# Altium schematic sheet LEDMATRIX.SchDoc: LED MATRIX
size A4; Author: Silvio Navaretti; CompanyName: ARDUINO SRL; DrawnBy: Silvio Navaretti; Engineer: Silvio Navaretti; Organization: ARDUINO SRL; DocumentNumber: ABX00087; Revision: V1.1; SheetNumber: 2; SheetTotal: 2; RevAuthor: Silvio Navaretti
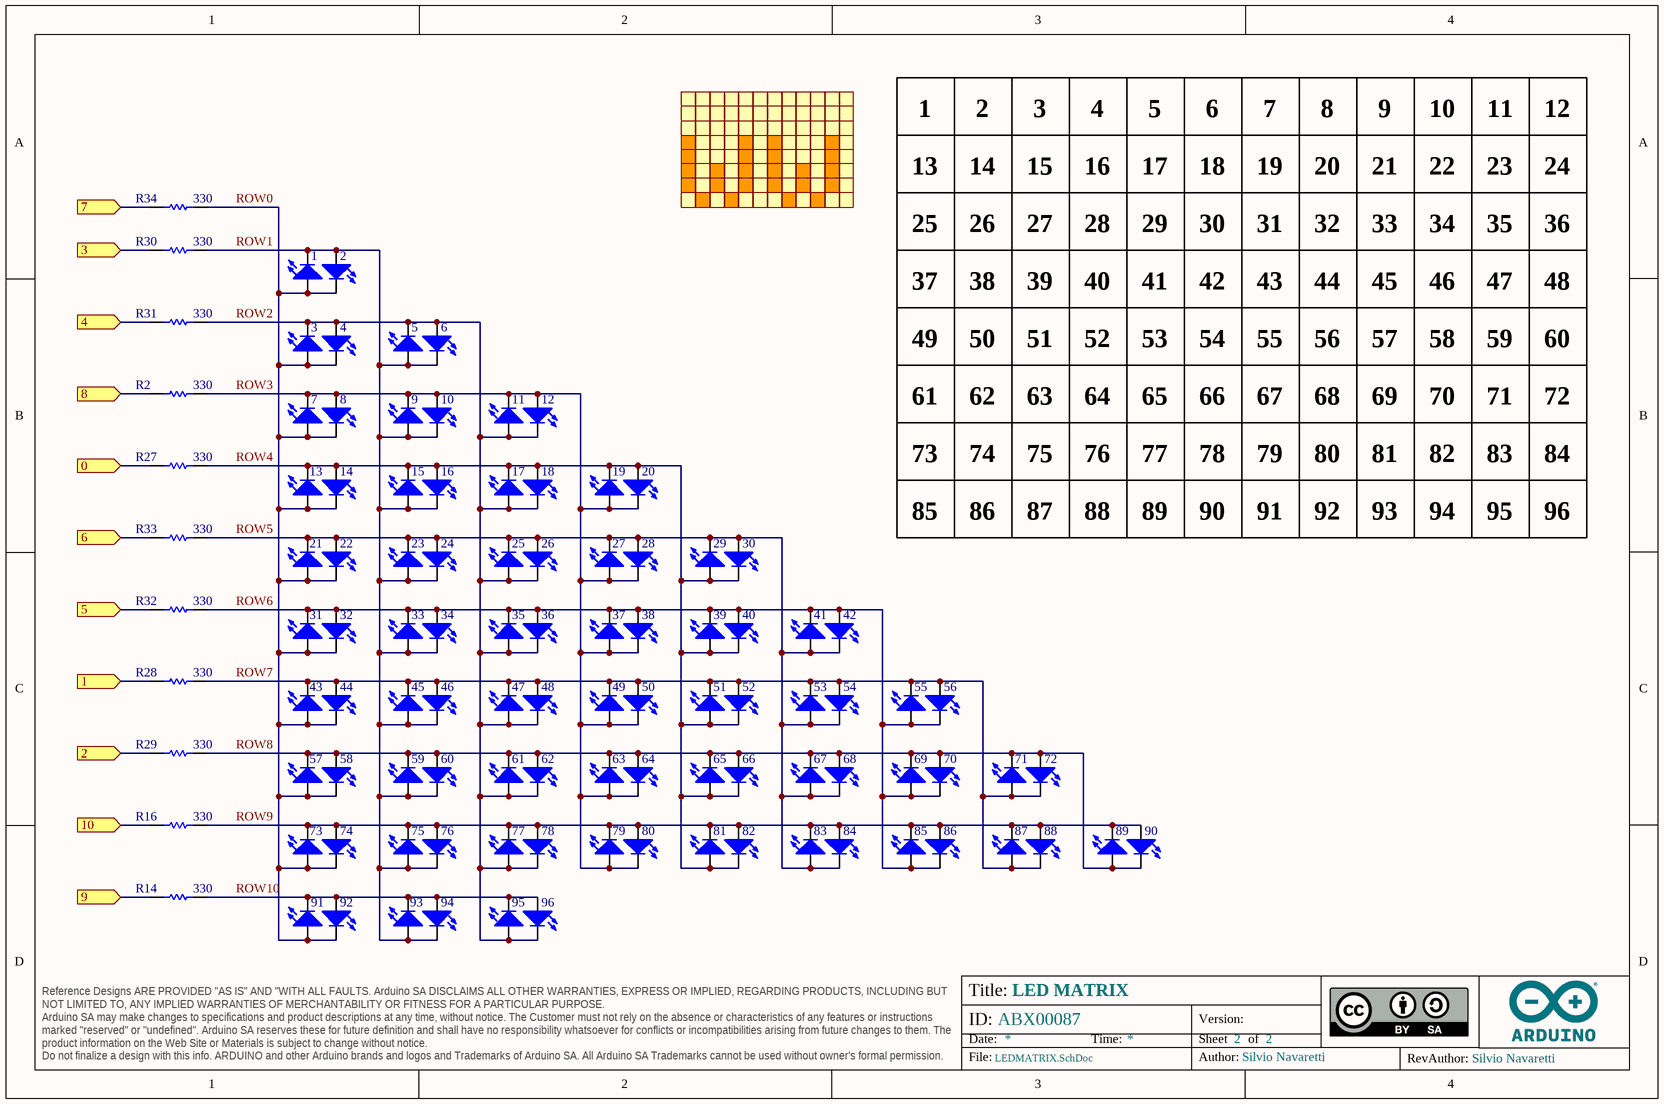
[diagram p0: LEDMATRIX.SchDoc]

## Parts
1  XHY-STB0603SR  [LEDC1608X80N-AK]  (value not drawn)
2  XHY-STB0603SR  [LEDC1608X80N-AK]  (value not drawn)
3  XHY-STB0603SR  [LEDC1608X80N-AK]  (value not drawn)
4  XHY-STB0603SR  [LEDC1608X80N-AK]  (value not drawn)
5  XHY-STB0603SR  [LEDC1608X80N-AK]  (value not drawn)
6  XHY-STB0603SR  [LEDC1608X80N-AK]  (value not drawn)
7  XHY-STB0603SR  [LEDC1608X80N-AK]  (value not drawn)
8  XHY-STB0603SR  [LEDC1608X80N-AK]  (value not drawn)
9  XHY-STB0603SR  [LEDC1608X80N-AK]  (value not drawn)
10  XHY-STB0603SR  [LEDC1608X80N-AK]  (value not drawn)
11  XHY-STB0603SR  [LEDC1608X80N-AK]  (value not drawn)
12  XHY-STB0603SR  [LEDC1608X80N-AK]  (value not drawn)
13  XHY-STB0603SR  [LEDC1608X80N-AK]  (value not drawn)
14  XHY-STB0603SR  [LEDC1608X80N-AK]  (value not drawn)
15  XHY-STB0603SR  [LEDC1608X80N-AK]  (value not drawn)
16  XHY-STB0603SR  [LEDC1608X80N-AK]  (value not drawn)
17  XHY-STB0603SR  [LEDC1608X80N-AK]  (value not drawn)
18  XHY-STB0603SR  [LEDC1608X80N-AK]  (value not drawn)
19  XHY-STB0603SR  [LEDC1608X80N-AK]  (value not drawn)
20  XHY-STB0603SR  [LEDC1608X80N-AK]  (value not drawn)
21  XHY-STB0603SR  [LEDC1608X80N-AK]  (value not drawn)
22  XHY-STB0603SR  [LEDC1608X80N-AK]  (value not drawn)
23  XHY-STB0603SR  [LEDC1608X80N-AK]  (value not drawn)
24  XHY-STB0603SR  [LEDC1608X80N-AK]  (value not drawn)
25  XHY-STB0603SR  [LEDC1608X80N-AK]  (value not drawn)
26  XHY-STB0603SR  [LEDC1608X80N-AK]  (value not drawn)
27  XHY-STB0603SR  [LEDC1608X80N-AK]  (value not drawn)
28  XHY-STB0603SR  [LEDC1608X80N-AK]  (value not drawn)
29  XHY-STB0603SR  [LEDC1608X80N-AK]  (value not drawn)
30  XHY-STB0603SR  [LEDC1608X80N-AK]  (value not drawn)
31  XHY-STB0603SR  [LEDC1608X80N-AK]  (value not drawn)
32  XHY-STB0603SR  [LEDC1608X80N-AK]  (value not drawn)
33  XHY-STB0603SR  [LEDC1608X80N-AK]  (value not drawn)
34  XHY-STB0603SR  [LEDC1608X80N-AK]  (value not drawn)
35  XHY-STB0603SR  [LEDC1608X80N-AK]  (value not drawn)
36  XHY-STB0603SR  [LEDC1608X80N-AK]  (value not drawn)
37  XHY-STB0603SR  [LEDC1608X80N-AK]  (value not drawn)
38  XHY-STB0603SR  [LEDC1608X80N-AK]  (value not drawn)
39  XHY-STB0603SR  [LEDC1608X80N-AK]  (value not drawn)
40  XHY-STB0603SR  [LEDC1608X80N-AK]  (value not drawn)
41  XHY-STB0603SR  [LEDC1608X80N-AK]  (value not drawn)
42  XHY-STB0603SR  [LEDC1608X80N-AK]  (value not drawn)
43  XHY-STB0603SR  [LEDC1608X80N-AK]  (value not drawn)
44  XHY-STB0603SR  [LEDC1608X80N-AK]  (value not drawn)
45  XHY-STB0603SR  [LEDC1608X80N-AK]  (value not drawn)
46  XHY-STB0603SR  [LEDC1608X80N-AK]  (value not drawn)
47  XHY-STB0603SR  [LEDC1608X80N-AK]  (value not drawn)
48  XHY-STB0603SR  [LEDC1608X80N-AK]  (value not drawn)
49  XHY-STB0603SR  [LEDC1608X80N-AK]  (value not drawn)
50  XHY-STB0603SR  [LEDC1608X80N-AK]  (value not drawn)
51  XHY-STB0603SR  [LEDC1608X80N-AK]  (value not drawn)
52  XHY-STB0603SR  [LEDC1608X80N-AK]  (value not drawn)
53  XHY-STB0603SR  [LEDC1608X80N-AK]  (value not drawn)
54  XHY-STB0603SR  [LEDC1608X80N-AK]  (value not drawn)
55  XHY-STB0603SR  [LEDC1608X80N-AK]  (value not drawn)
56  XHY-STB0603SR  [LEDC1608X80N-AK]  (value not drawn)
57  XHY-STB0603SR  [LEDC1608X80N-AK]  (value not drawn)
58  XHY-STB0603SR  [LEDC1608X80N-AK]  (value not drawn)
59  XHY-STB0603SR  [LEDC1608X80N-AK]  (value not drawn)
60  XHY-STB0603SR  [LEDC1608X80N-AK]  (value not drawn)
61  XHY-STB0603SR  [LEDC1608X80N-AK]  (value not drawn)
62  XHY-STB0603SR  [LEDC1608X80N-AK]  (value not drawn)
63  XHY-STB0603SR  [LEDC1608X80N-AK]  (value not drawn)
64  XHY-STB0603SR  [LEDC1608X80N-AK]  (value not drawn)
65  XHY-STB0603SR  [LEDC1608X80N-AK]  (value not drawn)
66  XHY-STB0603SR  [LEDC1608X80N-AK]  (value not drawn)
67  XHY-STB0603SR  [LEDC1608X80N-AK]  (value not drawn)
68  XHY-STB0603SR  [LEDC1608X80N-AK]  (value not drawn)
69  XHY-STB0603SR  [LEDC1608X80N-AK]  (value not drawn)
70  XHY-STB0603SR  [LEDC1608X80N-AK]  (value not drawn)
71  XHY-STB0603SR  [LEDC1608X80N-AK]  (value not drawn)
72  XHY-STB0603SR  [LEDC1608X80N-AK]  (value not drawn)
73  XHY-STB0603SR  [LEDC1608X80N-AK]  (value not drawn)
74  XHY-STB0603SR  [LEDC1608X80N-AK]  (value not drawn)
75  XHY-STB0603SR  [LEDC1608X80N-AK]  (value not drawn)
76  XHY-STB0603SR  [LEDC1608X80N-AK]  (value not drawn)
77  XHY-STB0603SR  [LEDC1608X80N-AK]  (value not drawn)
78  XHY-STB0603SR  [LEDC1608X80N-AK]  (value not drawn)
79  XHY-STB0603SR  [LEDC1608X80N-AK]  (value not drawn)
80  XHY-STB0603SR  [LEDC1608X80N-AK]  (value not drawn)
81  XHY-STB0603SR  [LEDC1608X80N-AK]  (value not drawn)
82  XHY-STB0603SR  [LEDC1608X80N-AK]  (value not drawn)
83  XHY-STB0603SR  [LEDC1608X80N-AK]  (value not drawn)
84  XHY-STB0603SR  [LEDC1608X80N-AK]  (value not drawn)
85  XHY-STB0603SR  [LEDC1608X80N-AK]  (value not drawn)
86  XHY-STB0603SR  [LEDC1608X80N-AK]  (value not drawn)
87  XHY-STB0603SR  [LEDC1608X80N-AK]  (value not drawn)
88  XHY-STB0603SR  [LEDC1608X80N-AK]  (value not drawn)
89  XHY-STB0603SR  [LEDC1608X80N-AK]  (value not drawn)
90  XHY-STB0603SR  [LEDC1608X80N-AK]  (value not drawn)
91  XHY-STB0603SR  [LEDC1608X80N-AK]  (value not drawn)
92  XHY-STB0603SR  [LEDC1608X80N-AK]  (value not drawn)
93  XHY-STB0603SR  [LEDC1608X80N-AK]  (value not drawn)
94  XHY-STB0603SR  [LEDC1608X80N-AK]  (value not drawn)
95  XHY-STB0603SR  [LEDC1608X80N-AK]  (value not drawn)
96  XHY-STB0603SR  [LEDC1608X80N-AK]  (value not drawn)
R2  value 330  [RES-0402]  (hidden comment: CRCW0402330RJNED)
R14  value 330  [RES-0402]  (hidden comment: CRCW0402330RJNED)
R16  value 330  [RES-0402]  (hidden comment: CRCW0402330RJNED)
R27  value 330  [RES-0402]  (hidden comment: CRCW0402330RJNED)
R28  value 330  [RES-0402]  (hidden comment: CRCW0402330RJNED)
R29  value 330  [RES-0402]  (hidden comment: CRCW0402330RJNED)
R30  value 330  [RES-0402]  (hidden comment: CRCW0402330RJNED)
R31  value 330  [RES-0402]  (hidden comment: CRCW0402330RJNED)
R32  value 330  [RES-0402]  (hidden comment: CRCW0402330RJNED)
R33  value 330  [RES-0402]  (hidden comment: CRCW0402330RJNED)
R34  value 330  [RES-0402]  (hidden comment: CRCW0402330RJNED)

## Ports
0 (in), 1 (in), 2 (in), 3 (in), 4 (in), 5 (in), 6 (in), 7 (in), 8 (in), 9 (in), 10 (in)

## Nets
0: R27.2 ; port 0
1: R28.2 ; port 1
2: R29.2 ; port 2
3: R30.2 ; port 3
4: R31.2 ; port 4
5: R32.2 ; port 5
6: R33.2 ; port 6
7: R34.2 ; port 7
8: R2.2 ; port 8
9: R14.2 ; port 9
10: R16.2 ; port 10
ROW0: 1.A 2.C 3.A 4.C 7.A 8.C 13.A 14.C 21.A 22.C 31.A 32.C 43.A 44.C 57.A 58.C 73.A 74.C 91.A 92.C R34.1
ROW1: 1.C 2.A 5.A 6.C 9.A 10.C 15.A 16.C 23.A 24.C 33.A 34.C 45.A 46.C 59.A 60.C 75.A 76.C 93.A 94.C R30.1
ROW2: 3.C 4.A 5.C 6.A 11.A 12.C 17.A 18.C 25.A 26.C 35.A 36.C 47.A 48.C 61.A 62.C 77.A 78.C 95.A 96.C R31.1
ROW3: 7.C 8.A 9.C 10.A 11.C 12.A 19.A 20.C 27.A 28.C 37.A 38.C 49.A 50.C 63.A 64.C 79.A 80.C R2.1
ROW4: 13.C 14.A 15.C 16.A 17.C 18.A 19.C 20.A 29.A 30.C 39.A 40.C 51.A 52.C 65.A 66.C 81.A 82.C R27.1
ROW5: 21.C 22.A 23.C 24.A 25.C 26.A 27.C 28.A 29.C 30.A 41.A 42.C 53.A 54.C 67.A 68.C 83.A 84.C R33.1
ROW6: 31.C 32.A 33.C 34.A 35.C 36.A 37.C 38.A 39.C 40.A 41.C 42.A 55.A 56.C 69.A 70.C 85.A 86.C R32.1
ROW7: 43.C 44.A 45.C 46.A 47.C 48.A 49.C 50.A 51.C 52.A 53.C 54.A 55.C 56.A 71.A 72.C 87.A 88.C R28.1
ROW8: 57.C 58.A 59.C 60.A 61.C 62.A 63.C 64.A 65.C 66.A 67.C 68.A 69.C 70.A 71.C 72.A 89.A 90.C R29.1
ROW9: 73.C 74.A 75.C 76.A 77.C 78.A 79.C 80.A 81.C 82.A 83.C 84.A 85.C 86.A 87.C 88.A 89.C 90.A R16.1
ROW10: 91.C 92.A 93.C 94.A 95.C 96.A R14.1

## Notes on the sheet
- 1
- 2
- 3
- 4
- 5
- 6
- 7
- 8
- 9
- 10
- 11
- 12
- 13
- 14
- 15
- 16
- 17
- 18
- 19
- 20
- 21
- 22
- 23
- 24
- 25
- 26
- 27
- 28
- 29
- 30
- 31
- 32
- 33
- 34
- 35
- 36
- 37
- 38
- 39
- 40
- 41
- 42
- 43
- 44
- 45
- 46
- 47
- 48
- 49
- 61
- 50
- 62
- 51
- 63
- 52
- 64
- 53
- 65
- 54
- 66
- 55
- 67
- 56
- 68
- 57
- 69
- 58
- 70
- 59
- 71
- 60
- 72
- 73
- 74
- 75
- 76
- 77
- 78
- 79
- 80
- 81
- 82
- 83
- 84
- 85
- 86
- 87
- 88
- 89
- 90
- 91
- 92
- 93
- 94
- 95
- 96
- Title:
- ID:
- Date:
- Time:
- Version:
- Sheet
- of
- RevAuthor:
- Reference Designs ARE PROVIDED "AS IS" AND "WITH ALL FAULTS. Arduino SA DISCLAIMS ALL OTHER WARRANTIES, EXPRESS OR IMPLIED, REGARDING PRODUCTS, INCLUDING BUT NOT LIMITED TO, ANY IMPLIED WARRANTIES OF MERCHANTABILITY OR FITNESS FOR A PARTICULAR PURPOSE.
  Arduino SA may make changes to specifications and product descriptions at any time, without notice. The Customer must not rely on the absence or characteristics of any features or instructions marked "reserved" or "undefined". Arduino SA reserves these for future definition and shall have no responsibility whatsoever for conflicts or incompatibilities arising from future changes to them. The product information on the Web Site or Materials is subject to change without notice.
  Do not finalize a design with this info. ARDUINO and other Arduino brands and logos and Trademarks of Arduino SA. All Arduino SA Trademarks cannot be used without owner's formal permission.
- File:
- Author:

## Library data of the parts
1-96 = L0024-A.4: LED SMD 0603 RED 625nm, water clear, 42 to 88 mcd, 120 degrees, 1.6x0.8x0.6mm; Manufacturer: Shenzen Corehy Technology; Code Arduino: L0024; Pin Count: 2; Part Number: XHY-STB0603SR
R2 R14 R16 R27-R34 = R0017-A.21: RES CHIP 0402 330R 5% 1/16W; Manufacturer: Vishay; Code Arduino: 2229; Power: 62.5mW; Temperature Coefficient: 200ppm; Part Number: CRCW0402330RJNED; Tolerance: 5%; Case Code (Imperial): 0402; Technology: Thick film